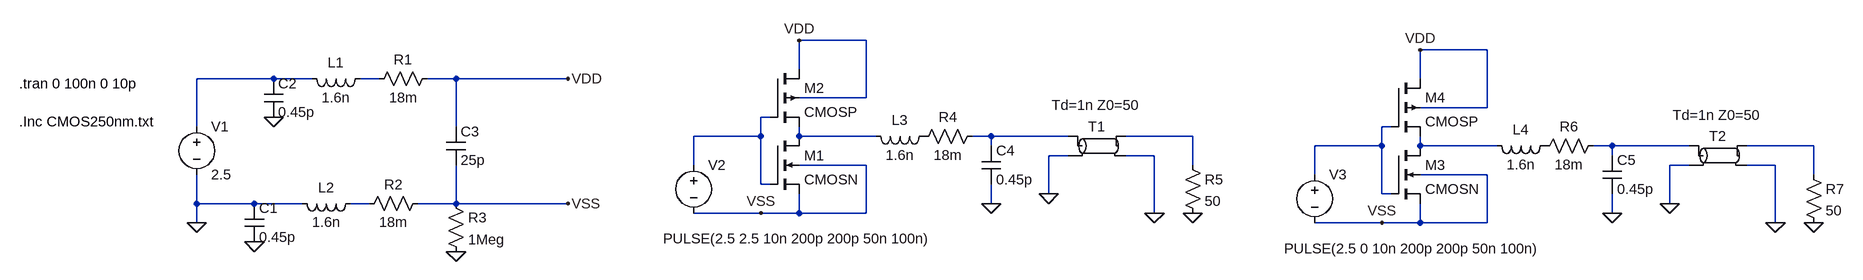
[diagram p0: schematic Exercise7.asc]
Exercise7.asc, the LTspice schematic file:
Version 4.1
SHEET 1 6996 680
WIRE 1920 -64 1808 -64
WIRE 2960 -48 2848 -48
WIRE 1808 -16 1808 -64
WIRE 272 0 144 0
WIRE 336 0 272 0
WIRE 448 0 416 0
WIRE 576 0 528 0
WIRE 928 0 576 0
WIRE 2848 0 2848 -48
WIRE 1920 32 1920 -64
WIRE 1920 32 1808 32
WIRE 2960 48 2960 -48
WIRE 2960 48 2848 48
WIRE 1760 64 1744 64
WIRE 144 80 144 0
WIRE 576 80 576 0
WIRE 2800 80 2784 80
WIRE 1744 96 1744 64
WIRE 1744 96 1632 96
WIRE 1808 96 1808 80
WIRE 1936 96 1808 96
WIRE 2128 96 2096 96
WIRE 2256 96 2128 96
WIRE 2464 96 2352 96
WIRE 2128 112 2128 96
WIRE 2784 112 2784 80
WIRE 2784 112 2672 112
WIRE 2848 112 2848 96
WIRE 2976 112 2848 112
WIRE 3168 112 3136 112
WIRE 3296 112 3168 112
WIRE 3504 112 3392 112
WIRE 2256 128 2224 128
WIRE 2400 128 2352 128
WIRE 3168 128 3168 112
WIRE 1632 144 1632 96
WIRE 1920 144 1808 144
WIRE 2464 144 2464 96
WIRE 3296 144 3264 144
WIRE 3440 144 3392 144
WIRE 2672 160 2672 112
WIRE 2960 160 2848 160
WIRE 3504 160 3504 112
WIRE 1744 176 1744 96
WIRE 1760 176 1744 176
WIRE 2224 192 2224 128
WIRE 2784 192 2784 112
WIRE 2800 192 2784 192
WIRE 144 208 144 160
WIRE 240 208 144 208
WIRE 320 208 240 208
WIRE 432 208 400 208
WIRE 576 208 576 144
WIRE 576 208 512 208
WIRE 928 208 576 208
WIRE 2128 208 2128 176
WIRE 3264 208 3264 144
WIRE 1744 224 1632 224
WIRE 1808 224 1808 192
WIRE 1808 224 1744 224
WIRE 1920 224 1920 144
WIRE 1920 224 1808 224
WIRE 2400 224 2400 128
WIRE 3168 224 3168 192
WIRE 144 240 144 208
WIRE 2784 240 2672 240
WIRE 2848 240 2848 208
WIRE 2848 240 2784 240
WIRE 2960 240 2960 160
WIRE 2960 240 2848 240
WIRE 3440 240 3440 144
FLAG 144 240 0
FLAG 240 272 0
FLAG 272 64 0
FLAG 576 288 0
FLAG 2128 208 0
FLAG 2224 192 0
FLAG 2400 224 0
FLAG 2464 224 0
FLAG 928 0 VDD
FLAG 1808 -64 VDD
FLAG 928 208 VSS
FLAG 1744 224 VSS
FLAG 3168 224 0
FLAG 3264 208 0
FLAG 3440 240 0
FLAG 3504 240 0
FLAG 2848 -48 VDD
FLAG 2784 240 VSS
SYMBOL voltage 144 64 R0
WINDOW 123 0 0 Left 0
WINDOW 39 0 0 Left 0
SYMATTR InstName V1
SYMATTR Value 2.5
SYMBOL cap 224 208 R0
SYMATTR InstName C1
SYMATTR Value 0.45p
SYMBOL cap 256 0 R0
SYMATTR InstName C2
SYMATTR Value 0.45p
SYMBOL ind 432 -16 R90
WINDOW 0 5 56 VBottom 2
WINDOW 3 32 56 VTop 2
SYMATTR InstName L1
SYMATTR Value 1.6n
SYMATTR SpiceLine Rser=1m
SYMBOL res 544 -16 R90
WINDOW 0 0 56 VBottom 2
WINDOW 3 32 56 VTop 2
SYMATTR InstName R1
SYMATTR Value 18m
SYMBOL ind 416 192 R90
WINDOW 0 5 56 VBottom 2
WINDOW 3 32 56 VTop 2
SYMATTR InstName L2
SYMATTR Value 1.6n
SYMATTR SpiceLine Rser=1m
SYMBOL res 528 192 R90
WINDOW 0 0 56 VBottom 2
WINDOW 3 32 56 VTop 2
SYMATTR InstName R2
SYMATTR Value 18m
SYMBOL cap 560 80 R0
SYMATTR InstName C3
SYMATTR Value 25p
SYMBOL res 560 192 R0
SYMATTR InstName R3
SYMATTR Value 1Meg
SYMBOL voltage 1632 128 R0
WINDOW 3 -51 139 Left 2
WINDOW 123 0 0 Left 0
WINDOW 39 0 0 Left 0
SYMATTR Value PULSE(2.5 2.5 10n 200p 200p 50n 100n)
SYMATTR InstName V2
SYMBOL ind 2032 80 R90
WINDOW 0 5 56 VBottom 2
WINDOW 3 32 56 VTop 2
SYMATTR InstName L3
SYMATTR Value 1.6n
SYMATTR SpiceLine Rser=1m
SYMBOL res 2112 80 R90
WINDOW 0 0 56 VBottom 2
WINDOW 3 32 56 VTop 2
SYMATTR InstName R4
SYMATTR Value 18m
SYMBOL cap 2112 112 R0
SYMATTR InstName C4
SYMATTR Value 0.45p
SYMBOL tline 2304 112 R0
WINDOW 3 -2 -83 Top 2
SYMATTR Value Td=1n Z0=50
SYMATTR InstName T1
SYMBOL res 2448 128 R0
SYMATTR InstName R5
SYMATTR Value 50
SYMBOL nmos4 1760 96 R0
SYMATTR InstName M1
SYMATTR Value CMOSN
SYMATTR Value2 l=0.25u w=50u
SYMBOL pmos4 1760 -16 R0
SYMATTR InstName M2
SYMATTR Value CMOSP
SYMATTR Value2 l=0.25u w=130u
SYMBOL voltage 2672 144 R0
WINDOW 3 -51 139 Left 2
WINDOW 123 0 0 Left 0
WINDOW 39 0 0 Left 0
SYMATTR Value PULSE(2.5 0 10n 200p 200p 50n 100n)
SYMATTR InstName V3
SYMBOL ind 3072 96 R90
WINDOW 0 5 56 VBottom 2
WINDOW 3 32 56 VTop 2
SYMATTR InstName L4
SYMATTR Value 1.6n
SYMATTR SpiceLine Rser=1m
SYMBOL res 3152 96 R90
WINDOW 0 0 56 VBottom 2
WINDOW 3 32 56 VTop 2
SYMATTR InstName R6
SYMATTR Value 18m
SYMBOL cap 3152 128 R0
SYMATTR InstName C5
SYMATTR Value 0.45p
SYMBOL tline 3344 128 R0
WINDOW 3 -2 -83 Top 2
SYMATTR Value Td=1n Z0=50
SYMATTR InstName T2
SYMBOL res 3488 144 R0
SYMATTR InstName R7
SYMATTR Value 50
SYMBOL nmos4 2800 112 R0
SYMATTR InstName M3
SYMATTR Value CMOSN
SYMATTR Value2 l=0.25u w=50u
SYMBOL pmos4 2800 0 R0
SYMATTR InstName M4
SYMATTR Value CMOSP
SYMATTR Value2 l=0.25u w=130u
TEXT -152 72 Left 2 !.Inc CMOS250nm.txt
TEXT -152 8 Left 2 !.tran 0 100n 0 10p

The netlist it stands for:
* Exercise7.asc
V1 N001 0 2.5
C1 0 0 0.45p
C2 N001 0 0.45p
L1 N002 N001 1.6n Rser=1m
R1 VDD N002 18m
L2 N011 0 1.6n Rser=1m
R2 VSS N011 18m
C3 VDD VSS 25p
R3 VSS 0 1Meg
V2 N003 VSS PULSE(2.5 2.5 10n 200p 200p 50n 100n)
L3 P001 N005 1.6n Rser=1m
R4 N006 P001 18m
C4 N006 0 0.45p
T1 N006 0 N007 0 Td=1n Z0=50
R5 N007 0 50
M1 N005 N003 VSS VSS CMOSN l=0.25u w=50u
M2 VDD N003 N005 VDD CMOSP l=0.25u w=130u
V3 N004 VSS PULSE(2.5 0 10n 200p 200p 50n 100n)
L4 P002 N008 1.6n Rser=1m
R6 N009 P002 18m
C5 N009 0 0.45p
T2 N009 0 N010 0 Td=1n Z0=50
R7 N010 0 50
M3 N008 N004 VSS VSS CMOSN l=0.25u w=50u
M4 VDD N004 N008 VDD CMOSP l=0.25u w=130u
.model NMOS NMOS
.model PMOS PMOS
.lib standard.mos
.Inc CMOS250nm.txt
.tran 0 100n 0 10p
.backanno
.end

* Results of the author's LTspice run, read from the files saved beside the schematic
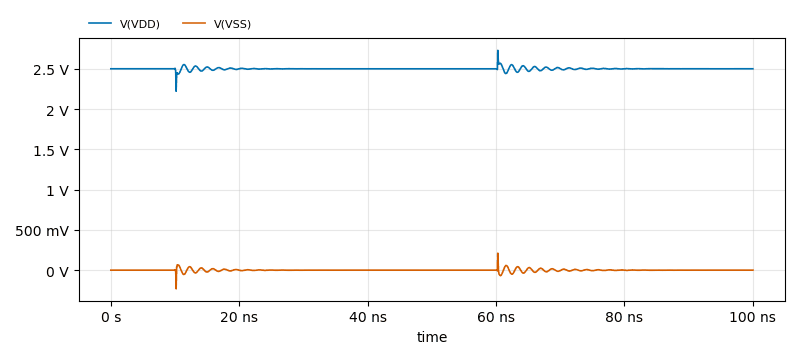
[diagram p1: Transient Analysis of Exercise7.asc, plotted from the saved traces]
* Transient Analysis, 1 run:
*   V(VDD): min 2.221 V, max 2.729 V, average 2.5 V, rms 2.5 V, last 2.5 V
*   V(VSS): min -231.6 mV, max 210.1 mV, average 246.7 nV, rms 13.53 mV, last -87.25 µV